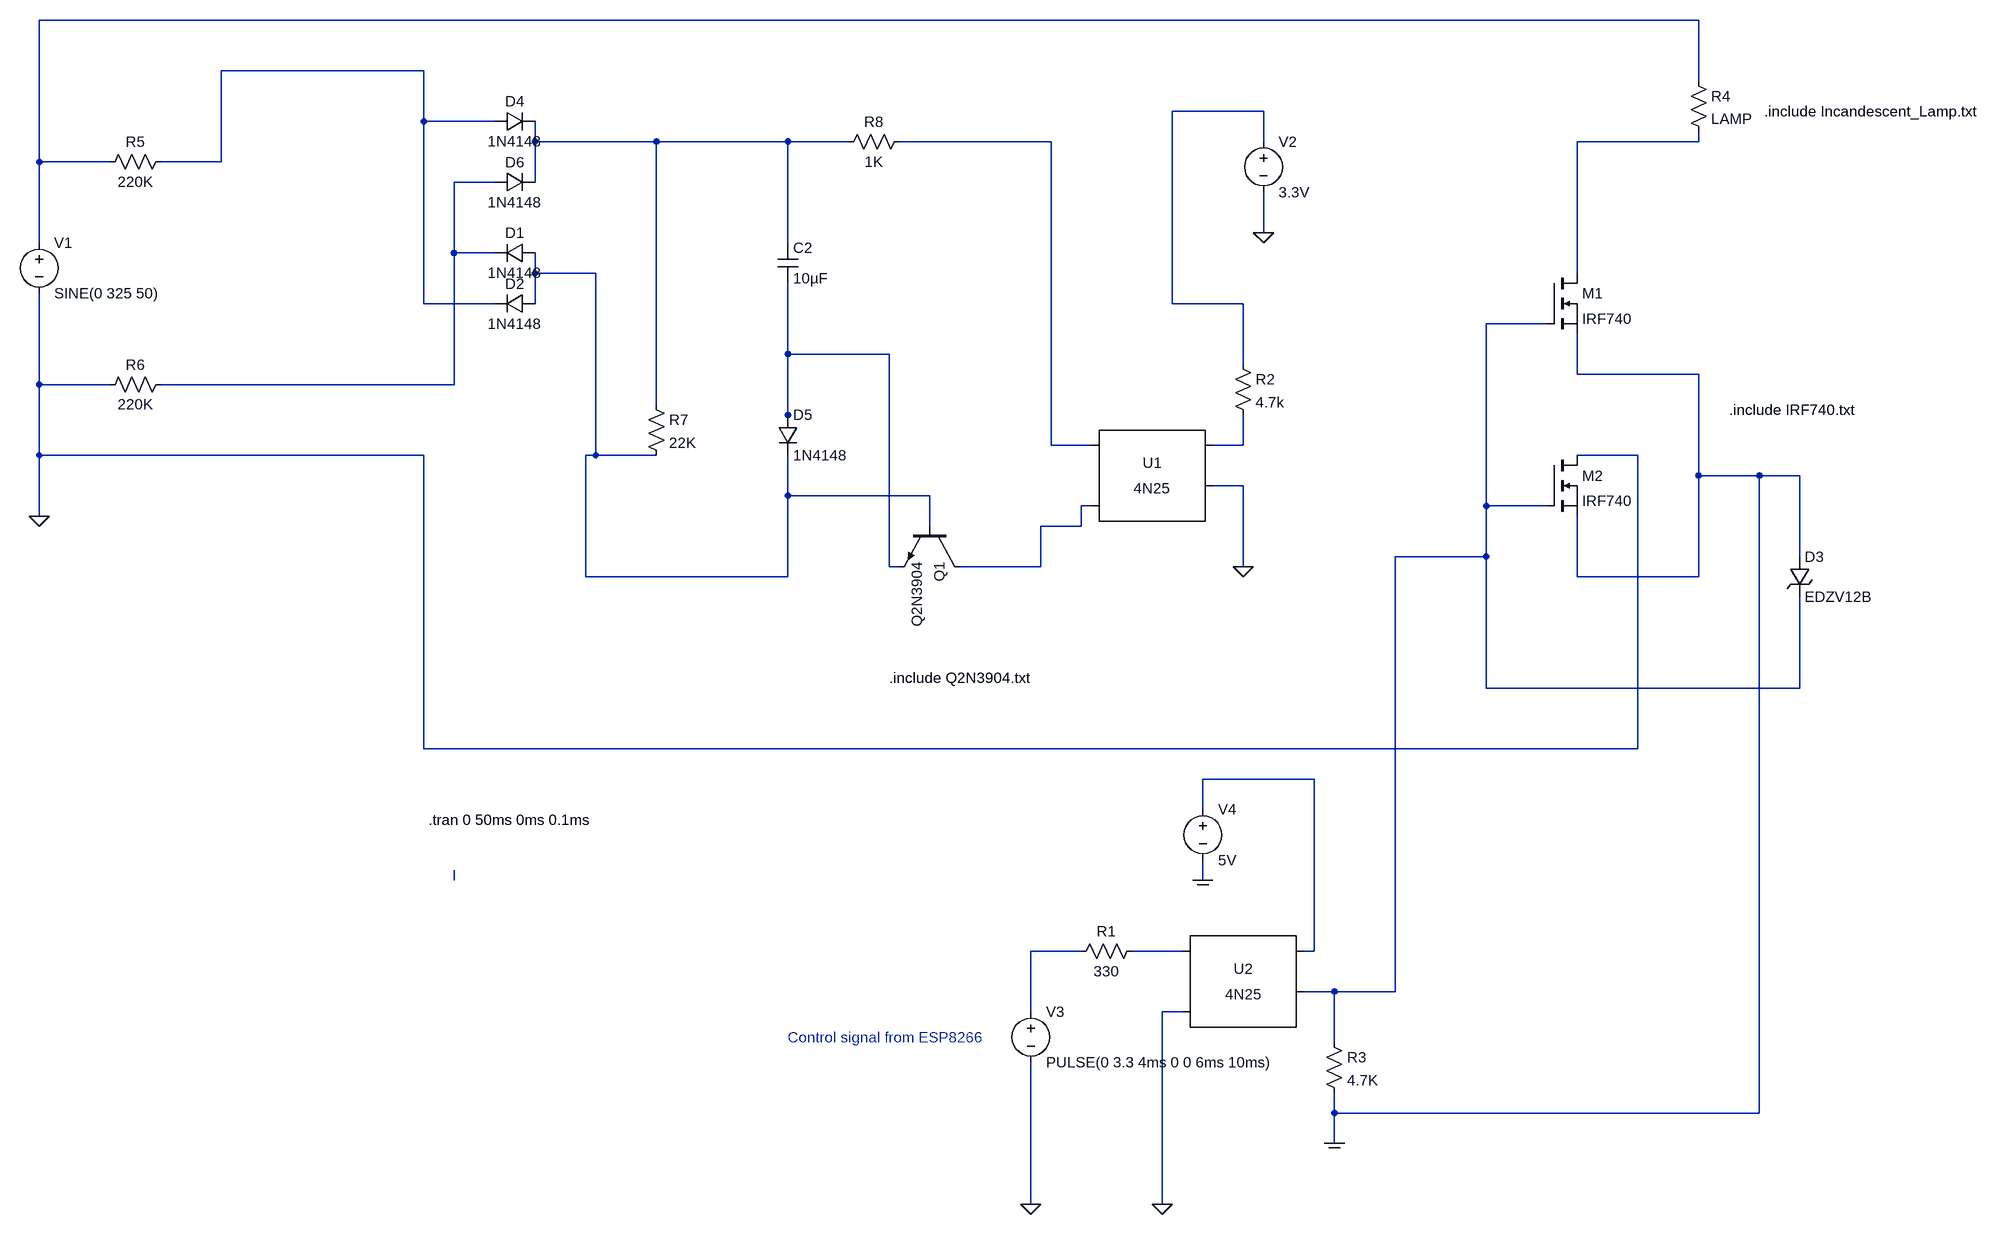
[diagram p0: schematic IRF740_V2.asc]
IRF740_V2.asc, the LTspice schematic file:
Version 4
SHEET 1 1968 1364
WIRE 896 -528 -1728 -528
WIRE -1120 -448 -1440 -448
WIRE 896 -432 896 -528
WIRE 208 -384 64 -384
WIRE -1120 -368 -1120 -448
WIRE -1008 -368 -1120 -368
WIRE -944 -336 -944 -368
WIRE -752 -336 -944 -336
WIRE -544 -336 -752 -336
WIRE -448 -336 -544 -336
WIRE -128 -336 -368 -336
WIRE 208 -336 208 -384
WIRE 896 -336 896 -352
WIRE 896 -336 704 -336
WIRE -1728 -304 -1728 -528
WIRE -1616 -304 -1728 -304
WIRE -1440 -304 -1440 -448
WIRE -1440 -304 -1536 -304
WIRE -1008 -272 -1072 -272
WIRE -944 -272 -944 -336
WIRE 208 -192 208 -256
WIRE -1728 -176 -1728 -304
WIRE -544 -176 -544 -336
WIRE -1072 -160 -1072 -272
WIRE -1008 -160 -1072 -160
WIRE -944 -128 -944 -160
WIRE -848 -128 -944 -128
WIRE 704 -128 704 -336
WIRE -1120 -80 -1120 -368
WIRE -1008 -80 -1120 -80
WIRE -944 -80 -944 -128
WIRE 64 -80 64 -384
WIRE 176 -80 64 -80
WIRE 656 -48 560 -48
WIRE -544 0 -544 -112
WIRE -384 0 -544 0
WIRE 176 16 176 -80
WIRE 704 32 704 -32
WIRE 896 32 704 32
WIRE -1728 48 -1728 -96
WIRE -1616 48 -1728 48
WIRE -1072 48 -1072 -160
WIRE -1072 48 -1536 48
WIRE -752 80 -752 -336
WIRE -544 96 -544 0
WIRE -544 112 -544 96
WIRE -128 144 -128 -336
WIRE -64 144 -128 144
WIRE 176 144 176 96
WIRE 176 144 128 144
WIRE -1728 160 -1728 48
WIRE -1120 160 -1728 160
WIRE -848 160 -848 -128
WIRE -848 160 -864 160
WIRE -752 160 -848 160
WIRE 800 160 704 160
WIRE 896 192 896 32
WIRE 992 192 896 192
WIRE 1056 192 992 192
WIRE 176 208 128 208
WIRE -544 224 -544 160
WIRE -320 224 -544 224
WIRE -64 240 -80 240
WIRE 560 240 560 -48
WIRE 656 240 560 240
WIRE -1728 256 -1728 160
WIRE -320 272 -320 224
WIRE -80 272 -80 240
WIRE -80 272 -144 272
WIRE 560 320 560 240
WIRE 560 320 416 320
WIRE 1056 320 1056 192
WIRE -384 336 -384 0
WIRE -368 336 -384 336
WIRE -144 336 -144 272
WIRE -144 336 -272 336
WIRE 176 336 176 208
WIRE -864 352 -864 160
WIRE -544 352 -544 224
WIRE -544 352 -864 352
WIRE 704 352 704 256
WIRE 896 352 896 192
WIRE 896 352 704 352
WIRE 560 528 560 320
WIRE 1056 528 1056 384
WIRE 1056 528 560 528
WIRE -1120 624 -1120 160
WIRE 800 624 800 160
WIRE 800 624 -1120 624
WIRE 288 672 112 672
WIRE 112 720 112 672
WIRE -1072 832 -1072 816
WIRE 112 832 112 800
WIRE -80 944 -160 944
WIRE 80 944 0 944
WIRE 288 944 288 672
WIRE 288 944 272 944
WIRE 320 1008 272 1008
WIRE 416 1008 416 320
WIRE 416 1008 320 1008
WIRE -160 1040 -160 944
WIRE 80 1040 48 1040
WIRE 320 1088 320 1008
WIRE 320 1200 320 1168
WIRE 992 1200 992 192
WIRE 992 1200 320 1200
WIRE 320 1248 320 1200
WIRE -160 1344 -160 1120
WIRE 48 1344 48 1040
FLAG 176 336 0
FLAG -1728 256 0
FLAG -160 1344 0
FLAG 112 832 COM
FLAG 320 1248 COM
FLAG 208 -192 0
FLAG 48 1344 0
SYMBOL Optos\\4N25 32 208 R0
SYMATTR InstName U1
SYMBOL res 160 0 R0
SYMATTR InstName R2
SYMATTR Value 4.7k
SYMBOL voltage -1728 -192 R0
WINDOW 123 0 0 Left 2
WINDOW 39 0 0 Left 2
SYMATTR InstName V1
SYMATTR Value SINE(0 325 50)
SYMBOL nmos 656 -128 R0
SYMATTR InstName M1
SYMATTR Value IRF740
SYMBOL nmos 656 160 R0
SYMATTR InstName M2
SYMATTR Value IRF740
SYMBOL voltage -160 1024 R0
WINDOW 123 0 0 Left 2
WINDOW 39 0 0 Left 2
SYMATTR InstName V3
SYMATTR Value PULSE(0 3.3 4ms 0 0 6ms 10ms)
SYMBOL res 880 -448 R0
SYMATTR InstName R4
SYMATTR Value LAMP
SYMATTR Prefix X
SYMBOL res -1520 -320 R90
WINDOW 0 0 56 VBottom 2
WINDOW 3 32 56 VTop 2
SYMATTR InstName R5
SYMATTR Value 220K
SYMBOL res -1520 32 R90
WINDOW 0 0 56 VBottom 2
WINDOW 3 32 56 VTop 2
SYMATTR InstName R6
SYMATTR Value 220K
SYMBOL res -768 64 R0
SYMATTR InstName R7
SYMATTR Value 22K
SYMBOL cap -560 -176 R0
SYMATTR InstName C2
SYMATTR Value 10µF
SYMBOL diode -560 96 R0
SYMATTR InstName D5
SYMATTR Value 1N4148
SYMBOL res -352 -352 R90
WINDOW 0 0 56 VBottom 2
WINDOW 3 32 56 VTop 2
SYMATTR InstName R8
SYMATTR Value 1K
SYMBOL npn -272 272 R90
SYMATTR InstName Q1
SYMATTR Value Q2N3904
SYMBOL diode -1008 -352 R270
WINDOW 0 32 32 VTop 2
WINDOW 3 0 32 VBottom 2
SYMATTR InstName D4
SYMATTR Value 1N4148
SYMBOL diode -1008 -256 R270
WINDOW 0 32 32 VTop 2
WINDOW 3 0 32 VBottom 2
SYMATTR InstName D6
SYMATTR Value 1N4148
SYMBOL diode -944 -176 R90
WINDOW 0 0 32 VBottom 2
WINDOW 3 32 32 VTop 2
SYMATTR InstName D1
SYMATTR Value 1N4148
SYMBOL diode -944 -96 R90
WINDOW 0 0 32 VBottom 2
WINDOW 3 32 32 VTop 2
SYMATTR InstName D2
SYMATTR Value 1N4148
SYMBOL zener 1040 320 R0
SYMATTR InstName D3
SYMATTR Value EDZV12B
SYMBOL Optos\\4N25 176 1008 R0
SYMATTR InstName U2
SYMBOL res 16 928 R90
WINDOW 0 0 56 VBottom 2
WINDOW 3 32 56 VTop 2
SYMATTR InstName R1
SYMATTR Value 330
SYMBOL voltage 112 704 R0
WINDOW 123 0 0 Left 2
WINDOW 39 0 0 Left 2
SYMATTR InstName V4
SYMATTR Value 5V
SYMBOL res 304 1072 R0
SYMATTR InstName R3
SYMATTR Value 4.7K
SYMBOL voltage 208 -352 R0
WINDOW 123 0 0 Left 2
WINDOW 39 0 0 Left 2
SYMATTR InstName V2
SYMATTR Value 3.3V
TEXT -1112 736 Left 2 !.tran 0 50ms 0ms 0.1ms
TEXT 944 88 Left 2 !.include IRF740.txt
TEXT 1000 -384 Left 2 !.include Incandescent_Lamp.txt
TEXT -384 512 Left 2 !.include Q2N3904.txt
TEXT -544 1080 Left 2 ;Control signal from ESP8266

The netlist it stands for:
* IRF740_V2.asc
XU1 N005 N012 N011 0 NC_01 4N25
R2 N003 N011 4.7k
V1 N001 0 SINE(0 325 50)
M1 N006 N009 COM COM IRF740
M2 0 N009 COM COM IRF740
V3 N015 0 PULSE(0 3.3 4ms 0 0 6ms 10ms)
XR4 N001 N006 LAMP  ; pins A B
R5 N002 N001 220K
R6 N007 0 220K
R7 N004 N008 22K
C2 N004 N010 10µF
D5 N010 N008 1N4148
R8 N005 N004 1K
Q1 N012 N008 N010 0 Q2N3904
D4 N002 N004 1N4148
D6 N007 N004 1N4148
D1 N008 N007 1N4148
D2 N008 N002 1N4148
D3 COM N009 EDZV12B
XU2 N016 0 N013 N009 NC_02 4N25
R1 N016 N015 330
V4 N013 COM 5V
R3 N009 COM 4.7K
V2 N003 0 3.3V
.model D D
.lib standard.dio
.model NPN NPN
.model PNP PNP
.lib standard.bjt
.model NMOS NMOS
.model PMOS PMOS
.lib standard.mos
.tran 0 50ms 0ms 0.1ms
.include IRF740.txt
.include Incandescent_Lamp.txt
.include Q2N3904.txt
* Control signal from ESP8266
.lib 4N25.sub
.backanno
.end